# Altium project QUTMS_SteeringWheelV2-V01.PrjPcb
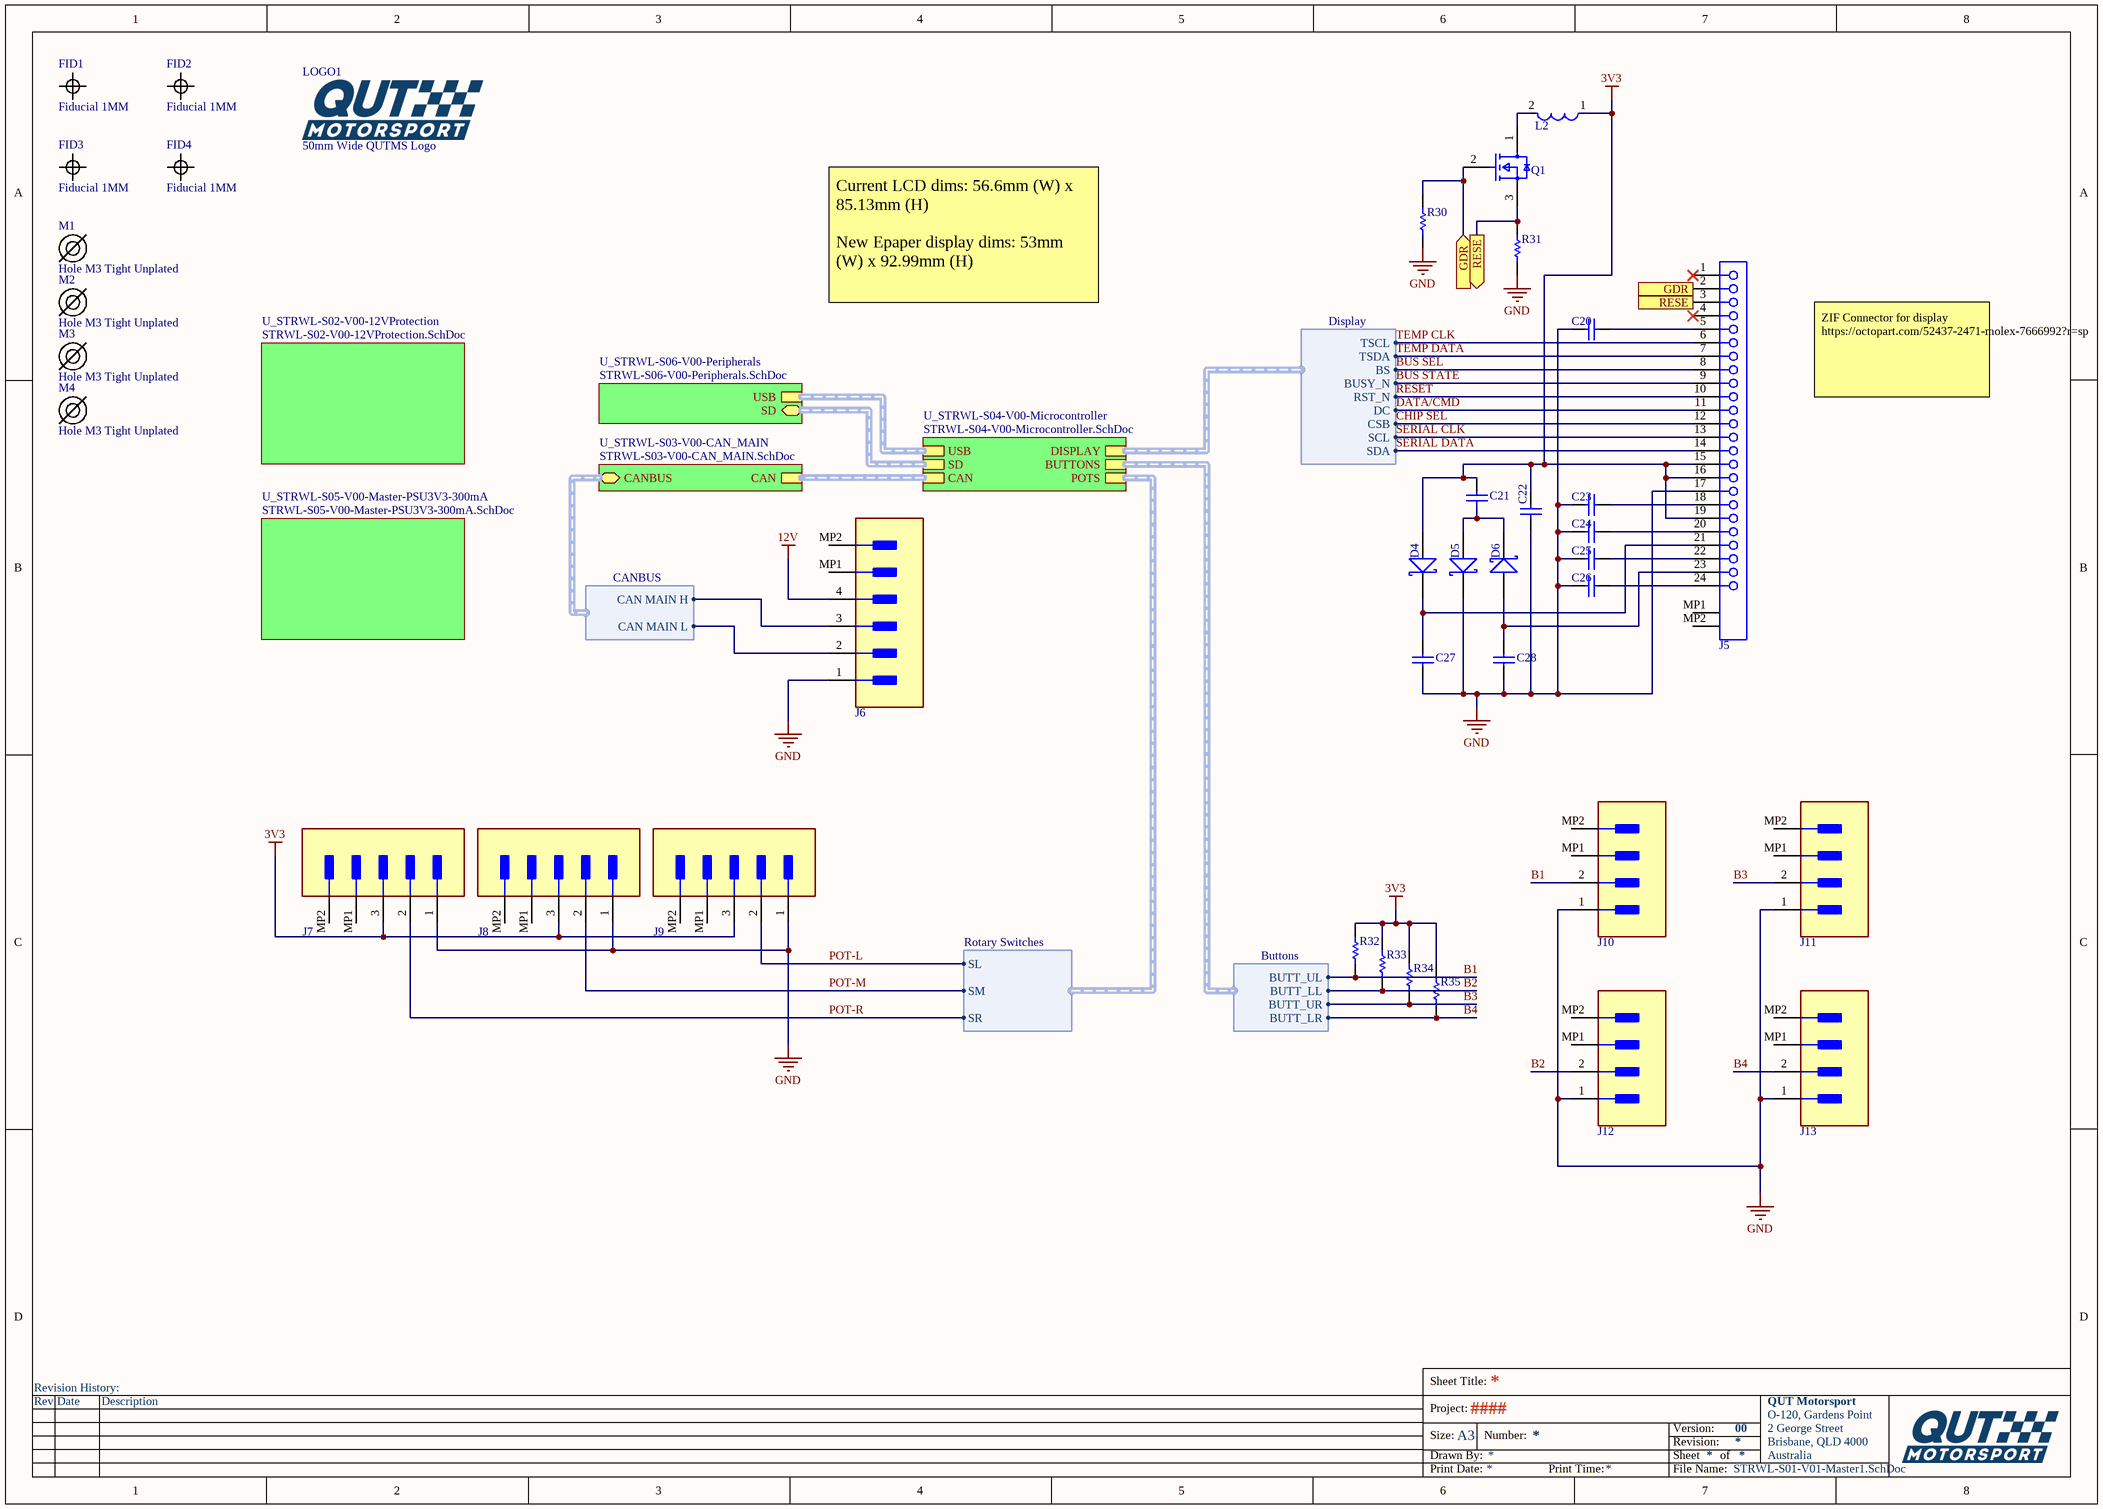
[diagram p0: STRWL-S01-V01-Master1.SchDoc]
4 sheets, 83 parts. Net scope: hierarchical (ports join the sheet entries above them; power ports are global).
Board file: STRWL-P01-V01.PcbDoc
Sheets:
  STRWL-S01-V01-Master1.SchDoc
    U_STRWL-S05-V00-Master-PSU3V3-300mA = STRWL-S05-V00-Master-PSU3V3-300mA.SchDoc
    U_STRWL-S06-V00-Peripherals = STRWL-S06-V00-Peripherals.SchDoc
    U_STRWL-S04-V00-Microcontroller = STRWL-S04-V00-Microcontroller.SchDoc

## Sheet STRWL-S01-V01-Master1.SchDoc
size A3; Version: 00; Project: ####; PageSetup: Record=PageOptions|CenterHorizontal=True|CenterVertical=True|PrintScale=0.97|XCorrection=1.00|YCorrection=1.00|PrintKind=0|BorderSize=5000000|LeftOffset=0|BottomOffset=0|Orientation=2|PaperLength=1000|PaperWidth=1000|Scale=100|PaperSource=7|PrintQuality=-4|MediaType=1|DitherType=10|PaperKind=A4|PrintScaleMode=1

### Parts
C20  1uF 25V 5% X7R 0603  [Cap_Ceramic_0603]  (value not drawn)
C21  4u7 50V 5% X7R 0603  [Cap_Ceramic_0603]  (value not drawn)
C22  1uF 25V 5% X7R 0603  [Cap_Ceramic_0603]  (value not drawn)
C23  1uF 25V 5% X7R 0603  [Cap_Ceramic_0603]  (value not drawn)
C24  1uF 25V 5% X7R 0603  [Cap_Ceramic_0603]  (value not drawn)
C25  1uF 25V 5% X7R 0603  [Cap_Ceramic_0603]  (value not drawn)
C26  1uF 25V 5% X7R 0603  [Cap_Ceramic_0603]  (value not drawn)
C27  1uF 25V 5% X7R 0603  [Cap_Ceramic_0603]  (value not drawn)
C28  1uF 25V 5% X7R 0603  [Cap_Ceramic_0603]  (value not drawn)
D4  STPS0530Z  [SOD123]  (value not drawn)
D5  STPS0530Z  [SOD123]  (value not drawn)
D6  STPS0530Z  [SOD123]  (value not drawn)
FID1  Fiducial 1MM  [FIDUCIAL 1MM]  (no BOM)
FID2  Fiducial 1MM  [FIDUCIAL 1MM]  (no BOM)
FID3  Fiducial 1MM  [FIDUCIAL 1MM]  (no BOM)
FID4  Fiducial 1MM  [FIDUCIAL 1MM]  (no BOM)
J5  52437-2471  [MOLX-52437-2471]  (value not drawn)
J6  JST PH 4 Way VERT SMD  [JST 4P VERT SMD]  (value not drawn)
J7  JST PH 3 Way VERT SMD  [JST 3P VERT SMD]  (value not drawn)
J8  JST PH 3 Way VERT SMD  [JST 3P VERT SMD]  (value not drawn)
J9  JST PH 3 Way VERT SMD  [JST 3P VERT SMD]  (value not drawn)
J10  JSP PH 2 Way VERT SMD  [JST 2P VERT SMD]  (value not drawn)
J11  JSP PH 2 Way VERT SMD  [JST 2P VERT SMD]  (value not drawn)
J12  JSP PH 2 Way VERT SMD  [JST 2P VERT SMD]  (value not drawn)
J13  JSP PH 2 Way VERT SMD  [JST 2P VERT SMD]  (value not drawn)
L2  LQM21FN100M70L  [Murata_LQM21FN_70_IPC_C]  (value not drawn)
LOGO1  50mm Wide QUTMS Logo  [QUTMS LOGO 50MM]  (no BOM)
M1  Hole M3 Tight Unplated  [M3.2 UNPLATED]
M2  Hole M3 Tight Unplated  [M3.2 UNPLATED]
M3  Hole M3 Tight Unplated  [M3.2 UNPLATED]
M4  Hole M3 Tight Unplated  [M3.2 UNPLATED]
Q1  MOSFET N-CH 30V 4A SOT323  [Diodes_SOT323_0]  (value not drawn)
R30  10k 1% 0603  [Res_ThinFilm_0603]  (value not drawn)
R31  0R47 5% 0603  [Res_ThinFilm_0603]  (value not drawn)
R32  10k 5% 0603  [Res_ThinFilm_0603]  (value not drawn)
R33  10k 5% 0603  [Res_ThinFilm_0603]  (value not drawn)
R34  10k 5% 0603  [Res_ThinFilm_0603]  (value not drawn)
R35  10k 5% 0603  [Res_ThinFilm_0603]  (value not drawn)

### Sub-sheets
U_STRWL-S02-V00-12VProtection = STRWL-S02-V00-12VProtection.SchDoc (file not in this document): no entries
U_STRWL-S03-V00-CAN_MAIN = STRWL-S03-V00-CAN_MAIN.SchDoc (file not in this document): CANBUS (bidir, harness CANBUS), CAN (harness CAN)
U_STRWL-S04-V00-Microcontroller = STRWL-S04-V00-Microcontroller.SchDoc: CAN (harness CAN), USB (harness USB), SD (harness SD), DISPLAY (harness Display), BUTTONS (harness Buttons), POTS (harness Rotary Switches)
U_STRWL-S05-V00-Master-PSU3V3-300mA = STRWL-S05-V00-Master-PSU3V3-300mA.SchDoc: no entries
U_STRWL-S06-V00-Peripherals = STRWL-S06-V00-Peripherals.SchDoc: USB (harness USB), SD (bidir, harness SD)

### Ports
GDR (in), GDR (out), RESE (in), RESE (out)

### Harnesses
CANBUS: CAN MAIN H, CAN MAIN L
Display: CSB, SCL, SDA, TSCL, TSDA, BS, BUSY_N, RST_N, DC
Buttons: BUTT_UL, BUTT_LL, BUTT_UR, BUTT_LR
Rotary Switches: SL, SM, SR

### Nets
3V3: C21.2 C22.2 D4.A J5.15 J5.16 J5.19 J7.3 J8.3 J9.3 L2.1 R32.1 R33.1 R34.2 R35.2
12V: J6.4
GND: C20.1 C22.1 C23.1 C24.1 C25.1 C26.1 C27.1 C28.1 D5.K J5.17 J6.1 J7.1 J8.1 J9.1 J10.1 J11.1 J12.1 J13.1 R30.2 R31.1
B1: J10.2 R32.2 ; sheet U_STRWL-S04-V00-Microcontroller/BUTTONS.BUTT_UL
B2: J12.2 R33.2 ; sheet U_STRWL-S04-V00-Microcontroller/BUTTONS.BUTT_LL
B3: J11.2 R34.1 ; sheet U_STRWL-S04-V00-Microcontroller/BUTTONS.BUTT_UR
B4: J13.2 R35.1 ; sheet U_STRWL-S04-V00-Microcontroller/BUTTONS.BUTT_LR
BUS SEL: J5.8 ; sheet U_STRWL-S04-V00-Microcontroller/DISPLAY.BS
BUS STATE: J5.9 ; sheet U_STRWL-S04-V00-Microcontroller/DISPLAY.BUSY_N
CHIP SEL: J5.12 ; sheet U_STRWL-S04-V00-Microcontroller/DISPLAY.CSB
DATA/CMD: J5.11 ; sheet U_STRWL-S04-V00-Microcontroller/DISPLAY.DC
POT-L: J9.2 ; sheet U_STRWL-S04-V00-Microcontroller/POTS.SL
POT-M: J8.2 ; sheet U_STRWL-S04-V00-Microcontroller/POTS.SM
POT-R: J7.2 ; sheet U_STRWL-S04-V00-Microcontroller/POTS.SR
RESET: J5.10 ; sheet U_STRWL-S04-V00-Microcontroller/DISPLAY.RST_N
SERIAL CLK: J5.13 ; sheet U_STRWL-S04-V00-Microcontroller/DISPLAY.SCL
SERIAL DATA: J5.14 ; sheet U_STRWL-S04-V00-Microcontroller/DISPLAY.SDA
TEMP CLK: J5.6 ; sheet U_STRWL-S04-V00-Microcontroller/DISPLAY.TSCL
TEMP DATA: J5.7 ; sheet U_STRWL-S04-V00-Microcontroller/DISPLAY.TSDA
NetC20_2: C20.2 J5.5
NetC21_1: C21.1 D5.A D6.K
NetC23_2: C23.2 J5.18
NetC24_2: C24.2 J5.20
NetC25_2: C25.2 J5.22
NetC26_2: C26.2 J5.24
NetC27_2: C27.2 D4.K J5.21
NetC28_2: C28.2 D6.A J5.23
NetJ5_2: J5.2 Q1.2(G) R30.1 ; port GDR
NetJ5_3: J5.3 Q1.3(S) R31.2 ; port RESE
NetJ6_2: J6.2 ; sheet U_STRWL-S03-V00-CAN_MAIN/CANBUS.CAN MAIN L
NetJ6_3: J6.3 ; sheet U_STRWL-S03-V00-CAN_MAIN/CANBUS.CAN MAIN H
NetL2_2: L2.2 Q1.1(D)

Not connected (* = marked no-connect by the designer): J5 1* 4* MP1 MP2; J6 MP1(MNT_1) MP2(MNT_2); J7 MP1(MNT_1) MP2(MNT_2); J8 MP1(MNT_1) MP2(MNT_2); J9 MP1(MNT_1) MP2(MNT_2); J10 MP1(MNT_1) MP2(MNT_2); J11 MP1(MNT_1) MP2(MNT_2); J12 MP1(MNT_1) MP2(MNT_2); J13 MP1(MNT_1) MP2(MNT_2)

### Buses and harness runs
harness sheet U_STRWL-S03-V00-CAN_MAIN/CAN = sheet U_STRWL-S04-V00-Microcontroller/CAN
harness sheet U_STRWL-S04-V00-Microcontroller/SD = sheet U_STRWL-S06-V00-Peripherals/SD
harness sheet U_STRWL-S04-V00-Microcontroller/USB = sheet U_STRWL-S06-V00-Peripherals/USB

### Notes on the sheet
- Current LCD dims: 56.6mm (W) x 85.13mm (H)
  New Epaper display dims: 53mm (W) x 92.99mm (H)
- ZIF Connector for display
  https://octopart.com/52437-2471-molex-7666992?r=sp
- Revision History:
- Sheet Title:
- Rev
- Date
- Description
- Project:
- Size:
- Drawn By:
- A3
- Number:
- Revision:
- Sheet
- Version:
- of
- QUT Motorsport
- O-120, Gardens Point
- 2 George Street
- Brisbane, QLD 4000
- Australia
- Print Date:
- Print Time:
- File Name:

### Library data of the parts
C20 C22-C28 = 1uF 25V 5% X7R 0603: Capacitor, Ceramic, SMD, 1uF, 25V, 5%, X7R, 0603
C21 = 4u7 50V 5% X7R 0603: Capacitor, Ceramic, SMD, 4u7, 50V, 5%, X7R, 0603
D4-D6 = STPS0530Z: Diode, Schottky Barrier Rectifier, 30 V, 0.5 A, STPS0530Z
J5 = 52437-2471: 0.5 mm Pitch Easy-On(TM) Type FPC Connector, Right Angle, ZIF, SMT, Bottom Contact, 24 Circuits, -40 to 85 degC, ELV and RoHS Compliant, Tape and Reel; Manufacturer: Molex; Durability (mating cycles max): 20; Material - Metal: Phosphor Bronze; Polarized to PCB: Yes; Voltage (Max): 50V; Entry Angle: 90degrees Angle; PCB Locator: No; Material - Plating Termination: Gold; Current (Max per Contact): 0.5A; PCB Retention: None; Pitch - Mating Interface: 0.50mm; Circuits (Loaded): 24; Contact Position: Bottom; PartNumber: 52437-2471; ComponentLink1Description: Manufacturer URL; ComponentLink2Description: Datasheet; ComponentLink3URL: http://www.molex.com/pdm_docs/sd/524372471_sd.pdf; ComponentLink3Description: Package Specification; ComponentLink1URL: http://www.molex.com/molex/index.jsp; Packing: Tape and Reel; Number of Rows: 1; ComponentLink2URL: http://www.molex.com/webdocs/datasheets/pdf/en-us/0524372471_FFC_FPC_CONNECTORS.pdf; PackageVersion: Rev. E, 07/2013; RoHS: TRUE; Material - Plating Mating: Gold; Orientation: Right Angle; Stackable: No; Mounting Technology: Surface Mount; PackageReference: 52437-2471; PackageDescription: 24-Lead FPC Connector, Pitch 0.5 mm
J10-J13 = JSP PH 2 Way VERT SMD: Manufacturer: JST; Category Bda670Ac885E6661: Uncategorized; Category E7012A0Bd22E3Cc6: Headers & Receptacles; contact_material: Brass; pin_pitch: 2 mm; size_length: 7.95 mm; Num Pins: 2; voltage_rating_ac: 100 V; contact_plating: Tin; Category Dab617Bcef8C0171: PC Board; Category E42C2926D3763Feb: Wire to Board; number_of_rows: 1; Category 75Fab8F04590Ae3D: Connectors and Adapters; size_width: 5 mm; gender: Female; current_rating: 2 A; size_height: 6.6 mm; insulation_resistance: 1 GΩ; Category 0836C53C3D42D3F1: Connectors; helpURL: https://upverter.com/upn/revision/aa2260f5f3c02952/; ComponentLink2Description: Datasheet; Temperature: -25˚C to +85˚C; Package: CONN_SMT_7MM95_5MM0; Supplier 2: Mouser; Price: 0.401172514632; Supplier 1: Digi-Key; ComponentLink1URL: https://upverter.com/upn/revision/aa2260f5f3c02952/; Supplier Part Number 1: 455-1734-1-ND; ComponentLink1Description: Upverter; ComponentLink2URL: https://upverter.com/datasheet/05f4473ffc638d76a3bb68900fd4324175be47ba.pdf; RoHS: TRUE; color: White; Category Fcf631Fcc9332731: Uncategorized; number_of_contacts: 2; Temperature Range Low: -25˚C; Digikey Part Number: 455-1734-1-ND; housing_color: Natural; Category A3C16Ecb93907806: Uncategorized; Temperature Range High: +85˚C; Lead Free: yes; flammability_rating: UL 94 V-0; Digikey Description: CONN 2 Positions Header, Shrouded Connector 0.079" (2.00mm) Surface Mount Tin; number_of_positions: 2; housing_material: Nylon; Mounting Type: surface mount
LOGO1 = QUTMS Logo 50mm
M1-M4 = Hole M3 Tight Unplated: M3.2 Hole, No Plating
Q1 = DMN3065LW-13: N-Channel 30V 4A (Ta) 770mW (Ta) Surface Mount SOT-323
R30 = 10k 1% 0603: Resistor, SMD, 10k, 0.1W, 1%, 0603
R31 = 0R47 5% 0603_1: Resistor, SMD, 0R, 0.1W, 5%, 0603
R32-R35 = 10k 5% 0603: Resistor, SMD, 10k, 0.1W, 5%, 0603

## Sheet STRWL-S05-V00-Master-PSU3V3-300mA.SchDoc: Power Supply (20-40V to 3v3 @ 0.1-0.6A)
size A3; DrawnBy: Jonn Dillon; DocumentNumber: 2; Revision: 01; SheetNumber: 5; SheetTotal: 7; Version: 01; Project: AMU 2020 (Sourced from BMS 2020); PageSetup: Record=PageOptions|CenterHorizontal=True|CenterVertical=True|PrintScale=0.97|XCorrection=1.00|YCorrection=1.00|PrintKind=0|BorderSize=5000000|LeftOffset=0|BottomOffset=0|Orientation=2|PaperLength=1000|PaperWidth=1000|Scale=100|PaperSource=7|PrintQuality=-4|MediaType=1|DitherType=10|PaperKind=A4|PrintScaleMode=1
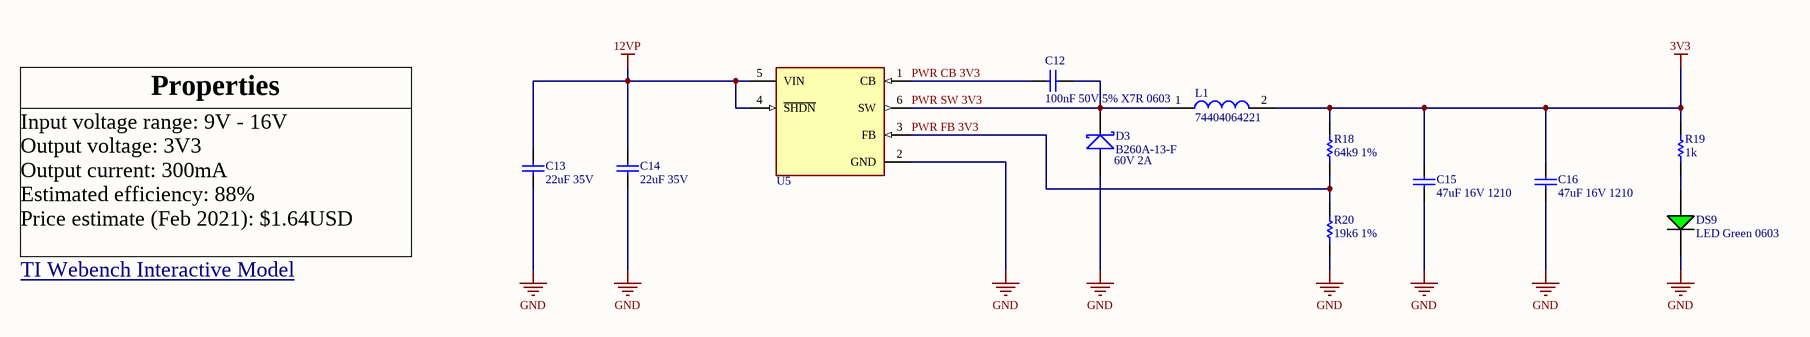
[diagram p1: STRWL-S05-V00-Master-PSU3V3-300mA.SchDoc]

### Parts
C12  100nF 50V 5% X7R 0603  [Cap_Ceramic_0603]
C13  22uF 35V  [Cap_Ceramic_1206]
C14  22uF 35V  [Cap_Ceramic_1206]
C15  47uF 16V 1210  [Cap_Ceramic_1210]
C16  47uF 16V 1210  [Cap_Ceramic_1210]
D3  B260A-13-F  [SMA]
DS9  LED Green 0603  [LED GREEN 0603]
L1  74404064221  [Inductor_6x6mm]
R18  64k9 1%  [Res_ThinFilm_0603]
R19  1k  [Res_ThinFilm_0603]
R20  19k6 1%  [Res_ThinFilm_0603]
U5  LMR14010ADDCR  [Texas_Instruments_DDC0006A_IPC_A]  (value not drawn)

### Nets
3V3: C15.2 C16.2 L1.2 R18.2 R19.2
12VP: C13.1 C14.1 U5.4(~{SHDN}) U5.5(VIN)
GND: C13.2 C14.2 C15.1 C16.1 D3.A DS9.2(C) R20.1 U5.2(GND)
PWR CB 3V3: C12.1 U5.1(CB)
PWR FB 3V3: R18.1 R20.2 U5.3(FB)
PWR SW 3V3: C12.2 D3.K L1.1 U5.6(SW)
NetDS9_1: DS9.1(A) R19.1

### Notes on the sheet
- Properties
- (near D3) 60V 2A
- Input voltage range: 9V - 16V
  Output voltage: 3V3
  Output current: 300mA
  Estimated efficiency: 88%
  Price estimate (Feb 2021): $1.64USD
- TI Webench Interactive Model <https://webench.ti.com/power-designer/switching-regulator/customize/16?O1I=0.3&O1V=3.3&VinMax=16.0&VinMin=9.0&action=schematic&base_pn=LMR14010A&lang_chosen=en_US&op_TA=30.0&optFactor=3&origin=ODS__LMR14010A>
- Title
- Size:
- Date:
- A3
- Number:
- Time:
- Revision:
- Sheet
- of
- File:

### Library data of the parts
C12 = 100nF 50V 5% X7R 0603: Capacitor, Ceramic, SMD, 100nF, 50V, 5%, X7R, 0603
C13 C14 = 22uF 35V 20% X5R 1206: 22µF ±20% 35V Ceramic Capacitor X5R 1206 (3216 Metric); ComponentLink1Description: Digikey; ComponentLink1URL: https://www.digikey.com.au/product-detail/en/tdk-corporation/C3216X5R1V226M160AC/445-8045-1-ND/2792165; ComponentLink2Description: Datasheet; ComponentLink2URL: https://product.tdk.com/info/en/catalog/datasheets/mlcc_commercial_general_en.pdf
C15 C16 = 47uF 16V 10% X7R 1210: Capacitor, Ceramic, SMD, 47uF, 16V, 5%, X7R, 1210
D3 = B260A-13-F: Diode, Schottky Barrier Rectifier, 60 V, 2 A, B260A-13-F
L1 = 74404064221: FIXED IND 220UH 660MA 850 MOHM; ComponentLink1Description: Digikey; ComponentLink1URL: https://www.digikey.com.au/product-detail/en/w%C3%BCrth-elektronik/74404064221/732-7261-1-ND/5353241; ComponentLink2Description: LCSC A; ComponentLink2URL: https://lcsc.com/product-detail/Power-Inductors_Sunlord-SWPA6045S221MT_C91047.html; ComponentLink3Description: LCSC B; ComponentLink3URL: https://lcsc.com/product-detail/Power-Inductors_SXN-Shun-Xiang-Nuo-Elec-SMNR6045-221MT_C467145.html
R18 = 64k9 1% 0603: Resistor, SMD, 64k9, 0.1W, 5%, 0603
R19 = 1k 5% 0603: Resistor, SMD, 1k, 0.1W, 5%, 0603
R20 = 19k6 1% 0603: Resistor, SMD, 19k6, 0.1W, 5%, 0603

## Sheet STRWL-S06-V00-Peripherals.SchDoc: Peripherals
size A3; DrawnBy: John Hatfield; SheetNumber: 6; SheetTotal: 6
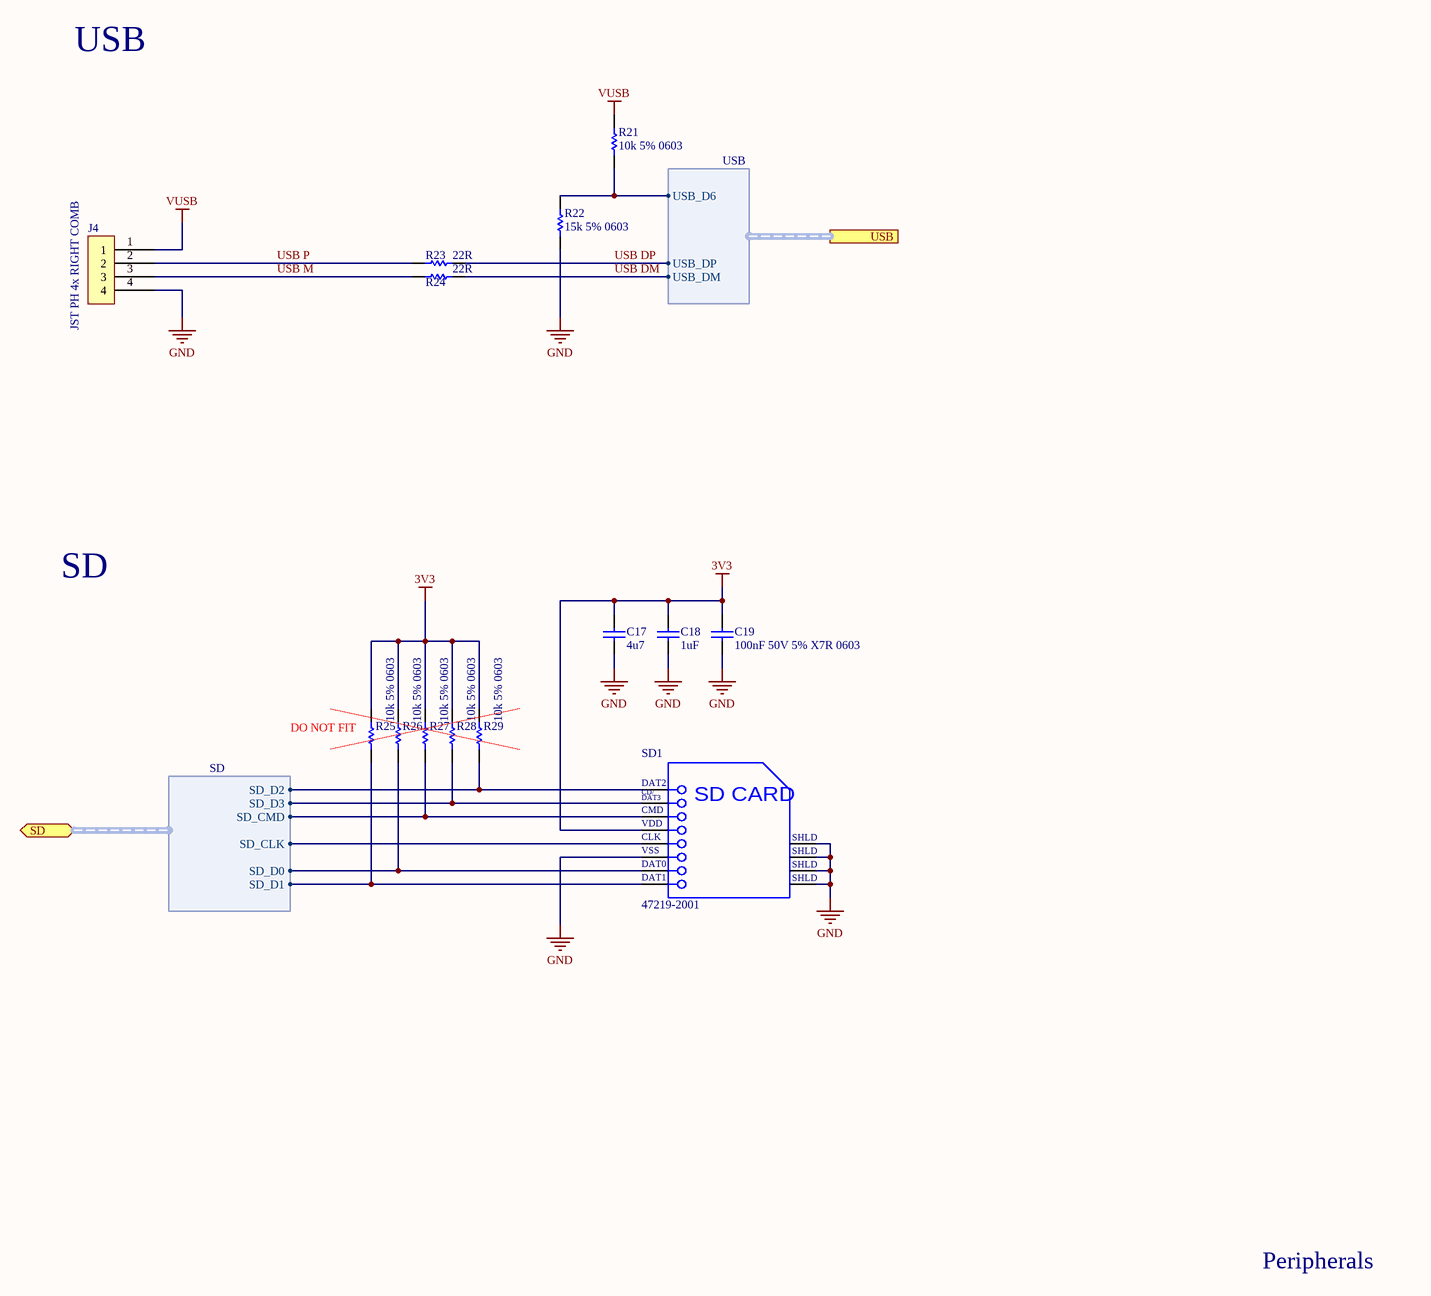
[diagram p2: STRWL-S06-V00-Peripherals.SchDoc]

### Parts
C17  4u7  [Cap_Ceramic_0603]
C18  1uF  [Cap_Ceramic_0603]
C19  100nF 50V 5% X7R 0603  [Cap_Ceramic_0603]
J4  JST PH 4x RIGHT COMB  [JST PH 4x RIGHT COMB]
R21  10k 5% 0603  [Res_ThinFilm_0603]
R22  15k 5% 0603  [Res_ThinFilm_0603]
R23  22R  [Res_ThinFilm_0603]
R24  22R  [Res_ThinFilm_0603]
R25  10k 5% 0603  [Res_ThinFilm_0603]
R26  10k 5% 0603  [Res_ThinFilm_0603]
R27  10k 5% 0603  [Res_ThinFilm_0603]
R28  10k 5% 0603  [Res_ThinFilm_0603]
R29  10k 5% 0603  [Res_ThinFilm_0603]
SD1  47219-2001  [47219-2001]

### Ports
SD (bidir, harness SD), USB (harness USB)

### Harnesses
USB: USB_DP, USB_D6, USB_DM
SD: SD_D2, SD_D3, SD_CMD, SD_CLK, SD_D0, SD_D1

### Nets
3V3: C17.2 C18.2 C19.2 R25.2 R26.2 R27.2 R28.2 R29.2 SD1.4(VDD)
GND: C17.1 C18.1 C19.1 J4.4 R22.1 SD1.6(VSS) SD1.9(SHLD) SD1.10(SHLD) SD1.11(SHLD) SD1.12(SHLD)
VUSB: J4.1 R21.2
SD_CMD: R27.1 SD1.3(CMD) ; port SD.SD_CMD
SD_D0: R26.1 SD1.7(DAT0) ; port SD.SD_D0
SD_D1: R25.1 SD1.8(DAT1) ; port SD.SD_D1
SD_D2: R29.1 SD1.1(DAT2) ; port SD.SD_D2
SD_D3: R28.1 SD1.2(CD/DAT3) ; port SD.SD_D3
SDIO_CK: SD1.5(CLK) ; port SD.SD_CLK
USB DM: R24.2 ; port USB.USB_DM
USB DP: R23.2 ; port USB.USB_DP
USB M: J4.3 R24.1
USB P: J4.2 R23.1
USB_D6: R21.1 R22.2 ; port USB.USB_D6

### Notes on the sheet
- USB
- SD
- (near R25) DO NOT FIT
- Peripherals
- (in symbol 47219-2001) CD/; DAT3; SD CARD

### Library data of the parts
C17 = 4u7 50V 5% X7R 0603: as C21 on sheet STRWL-S01-V01-Master1
C18 = 1uF 25V 5% X7R 0603: as C20 on sheet STRWL-S01-V01-Master1
C19 = 100nF 50V 5% X7R 0603: as C12 on sheet STRWL-S05-V00-Master-PSU3V3-300mA
R21 R25-R29 = 10k 5% 0603: Resistor, SMD, 10k, 0.1W, 5%, 0603
R22 = 15k 5% 0603: Resistor, SMD, 15k, 0.1W, 5%, 0603
R23 R24 = 22R 1% 0603: Resistor, SMD, 22R, 0.1W, 1%, 0603
SD1 = 47219-2001: MicroSD Card Connector, Hinge Type, -40 to 85 degC, 8-Pin SMD, RoHS, Tape and Reel

## Sheet STRWL-S04-V00-Microcontroller.SchDoc: STRWL Microcontroller
size A3; DrawnBy: John Hatfield; DocumentNumber: 4; Revision: 01; SheetNumber: 4; SheetTotal: 6; Version: 01; Project: STRWL QEV3; PageSetup: Record=PageOptions|CenterHorizontal=True|CenterVertical=True|PrintScale=0.97|XCorrection=1.00|YCorrection=1.00|PrintKind=0|BorderSize=5000000|LeftOffset=0|BottomOffset=0|Orientation=2|PaperLength=1000|PaperWidth=1000|Scale=100|PaperSource=7|PrintQuality=-4|MediaType=1|DitherType=10|PaperKind=A4|PrintScaleMode=1
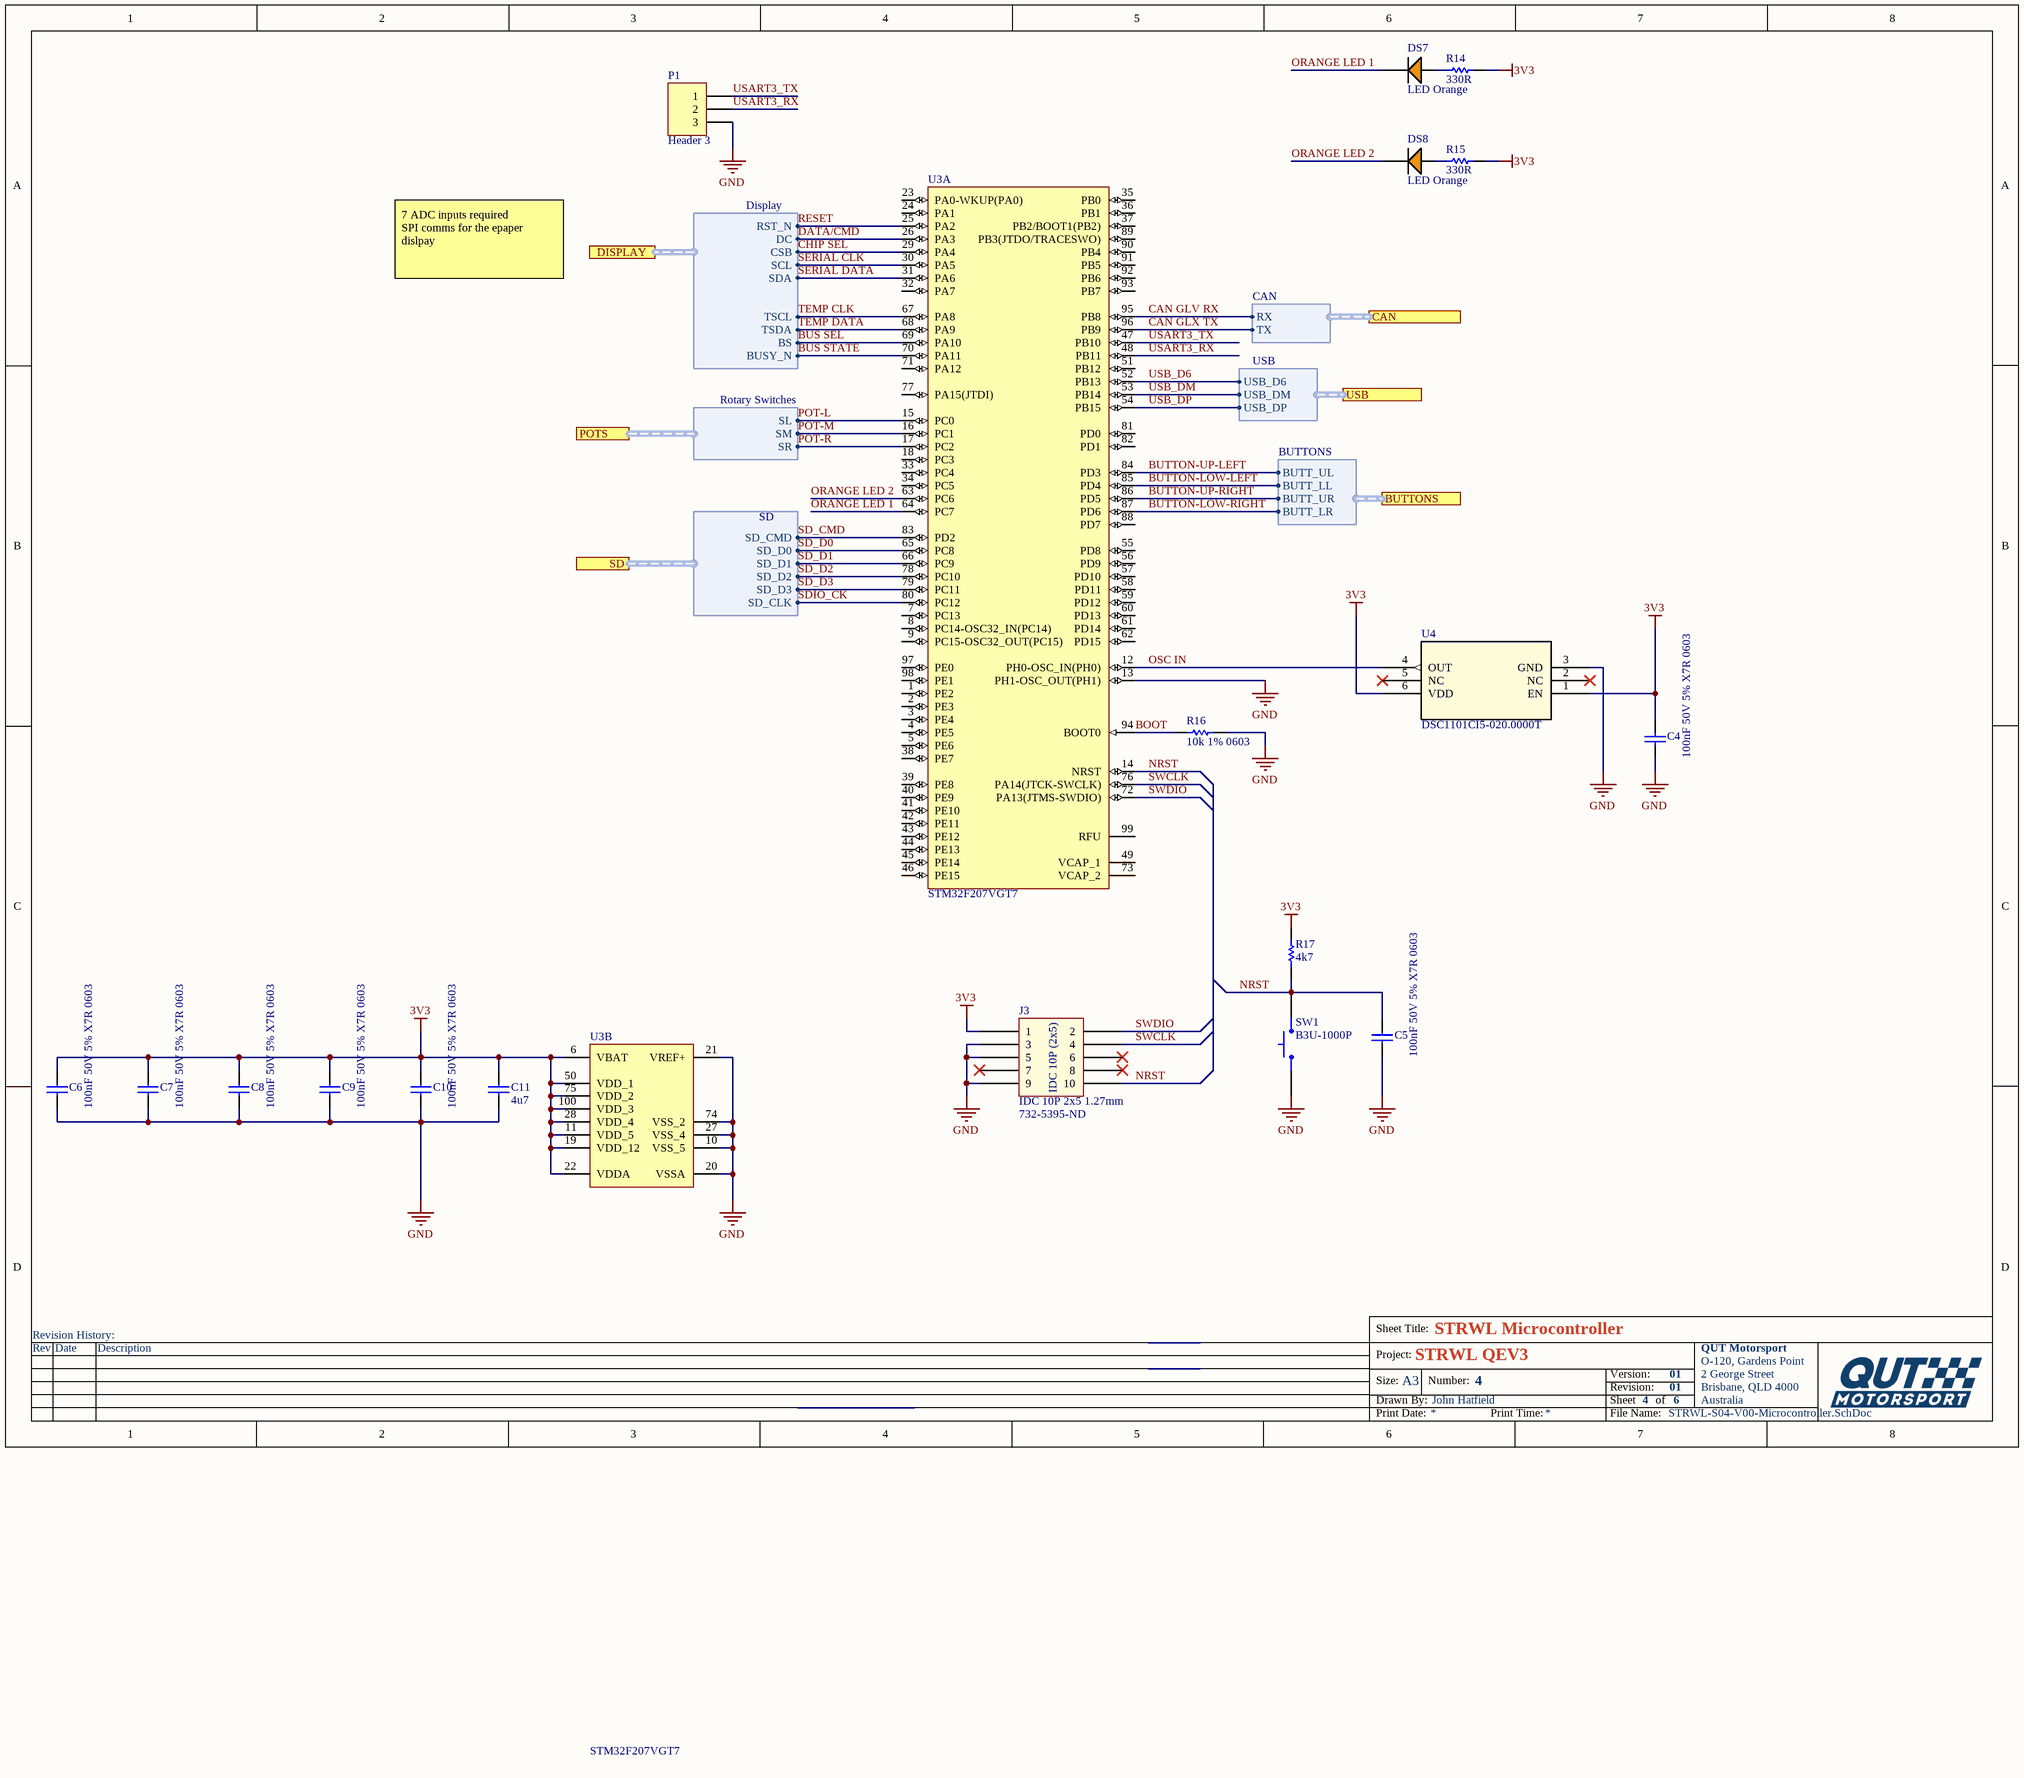
[diagram p3: STRWL-S04-V00-Microcontroller.SchDoc]

### Parts
C4  100nF 50V 5% X7R 0603  [Cap_Ceramic_0603]
C5  100nF 50V 5% X7R 0603  [Cap_Ceramic_0603]
C6  100nF 50V 5% X7R 0603  [Cap_Ceramic_0603]
C7  100nF 50V 5% X7R 0603  [Cap_Ceramic_0603]
C8  100nF 50V 5% X7R 0603  [Cap_Ceramic_0603]
C9  100nF 50V 5% X7R 0603  [Cap_Ceramic_0603]
C10  100nF 50V 5% X7R 0603  [Cap_Ceramic_0603]
C11  4u7  [Cap_Ceramic_0603]
DS7  LED Orange  [LED ORANGE 0603]
DS8  LED Orange  [LED ORANGE 0603]
J3  IDC 10P 2x5 1.27mm  [IDC 1.27MM 10P]
P1  Header 3  [HDR1X3]
R14  330R  [Res_ThinFilm_0603]
R15  330R  [Res_ThinFilm_0603]
R16  10k 1% 0603  [Res_ThinFilm_0603]
R17  4k7  [Res_ThinFilm_0603]
SW1  B3U-1000P  [BTN B3U-1000P]
U3  STM32F207VGT7  [STM-LQFP100_N]  (parts A,B of 2)
U4  DSC1101CI5-020.0000T  [VDFN6_3P2X2P5_MCH]

### Ports
BUTTONS (harness BUTTONS), CAN (harness CAN), DISPLAY (harness Display), POTS (harness Rotary Switches), SD (harness SD), USB (harness USB)

### Harnesses
CAN: RX, TX
USB: USB_DM, USB_DP, USB_D6
SD: SD_D0, SD_D1, SD_D2, SD_D3, SD_CLK, SD_CMD
Display: RST_N, DC, CSB, SCL, SDA, TSCL, TSDA, BS, BUSY_N
BUTTONS: BUTT_UL, BUTT_LL, BUTT_UR, BUTT_LR
Rotary Switches: SL, SM, SR

### Nets
3V3: C4.2 C6.2 C7.2 C8.2 C9.2 C10.2 C11.2 J3.1 R14.2 R15.2 R17.2 U3.6(VBAT) U3.11(VDD_5) U3.19(VDD_12) U3.22(VDDA) U3.28(VDD_4) U3.50(VDD_1) U3.75(VDD_2) U3.100(VDD_3) U4.1(EN) U4.6(VDD)
GND: C4.1 C5.1 C6.1 C7.1 C8.1 C9.1 C10.1 C11.1 J3.3 J3.5 J3.9 P1.3 R16.2 SW1.1 U3.10(VSS_5) U3.13(PH1-OSC_OUT(PH1)) U3.20(VSSA) U3.21(VREF+) U3.27(VSS_4) U3.74(VSS_2) U4.3(GND)
BOOT: R16.1 U3.94(BOOT0)
BUS SEL: U3.69(PA10) ; port DISPLAY.BS
BUS STATE: U3.70(PA11) ; port DISPLAY.BUSY_N
BUTTON-LOW-LEFT: U3.85(PD4) ; port BUTTONS.BUTT_LL  [project net B2]
BUTTON-LOW-RIGHT: U3.87(PD6) ; port BUTTONS.BUTT_LR  [project net B4]
BUTTON-UP-LEFT: U3.84(PD3) ; port BUTTONS.BUTT_UL  [project net B1]
BUTTON-UP-RIGHT: U3.86(PD5) ; port BUTTONS.BUTT_UR  [project net B3]
CAN GLV RX: U3.95(PB8) ; port CAN.RX
CAN GLX TX: U3.96(PB9) ; port CAN.TX
CHIP SEL: U3.29(PA4) ; port DISPLAY.CSB
DATA/CMD: U3.26(PA3) ; port DISPLAY.DC
NRST: C5.2 J3.10 R17.1 SW1.2 U3.14(NRST)
ORANGE LED 1: DS7.2(C) U3.64(PC7)
ORANGE LED 2: DS8.2(C) U3.63(PC6)
OSC IN: U3.12(PH0-OSC_IN(PH0)) U4.4(OUT)
POT-L: U3.15(PC0) ; port POTS.SL
POT-M: U3.16(PC1) ; port POTS.SM
POT-R: U3.17(PC2) ; port POTS.SR
RESET: U3.25(PA2) ; port DISPLAY.RST_N
SD_CMD: U3.83(PD2) ; port SD.SD_CMD
SD_D0: U3.65(PC8) ; port SD.SD_D0
SD_D1: U3.66(PC9) ; port SD.SD_D1
SD_D2: U3.78(PC10) ; port SD.SD_D2
SD_D3: U3.79(PC11) ; port SD.SD_D3
SDIO_CK: U3.80(PC12) ; port SD.SD_CLK
SERIAL CLK: U3.30(PA5) ; port DISPLAY.SCL
SERIAL DATA: U3.31(PA6) ; port DISPLAY.SDA
SWCLK: J3.4 U3.76(PA14(JTCK-SWCLK))
SWDIO: J3.2 U3.72(PA13(JTMS-SWDIO))
TEMP CLK: U3.67(PA8) ; port DISPLAY.TSCL
TEMP DATA: U3.68(PA9) ; port DISPLAY.TSDA
USART3_RX: P1.2 U3.48(PB11)
USART3_TX: P1.1 U3.47(PB10)
USB_D6: U3.52(PB13) ; port USB.USB_D6
USB_DM: U3.53(PB14) ; port USB.USB_DM  [project net USB DM]
USB_DP: U3.54(PB15) ; port USB.USB_DP  [project net USB DP]
NetDS7_1: DS7.1(A) R14.1
NetDS8_1: DS8.1(A) R15.1

Not connected (* = marked no-connect by the designer): J3 6* 7* 8*; U3 1(PE2) 2(PE3) 3(PE4) 4(PE5) 5(PE6) 7(PC13) 8(PC14-OSC32_IN(PC14)) 9(PC15-OSC32_OUT(PC15)) 18(PC3) 23(PA0-WKUP(PA0)) 24(PA1) 32(PA7) 33(PC4) 34(PC5) 35(PB0) 36(PB1) 37(PB2/BOOT1(PB2)) 38(PE7) 39(PE8) 40(PE9) 41(PE10) 42(PE11) 43(PE12) 44(PE13) 45(PE14) 46(PE15) 49(VCAP_1) 51(PB12) 55(PD8) 56(PD9) 57(PD10) 58(PD11) 59(PD12) 60(PD13) 61(PD14) 62(PD15) 71(PA12) 73(VCAP_2) 77(PA15(JTDI)) 81(PD0) 82(PD1) 88(PD7) 89(PB3(JTDO/TRACESWO)) 90(PB4) 91(PB5) 92(PB6) 93(PB7) 97(PE0) 98(PE1) 99(RFU); U4 2(NC)* 5(NC)*

### Notes on the sheet
- 7 ADC inputs required
  SPI comms for the epaper dislpay
- (near J3) 732-5395-ND
- Revision History:
- Sheet Title:
- Rev
- Date
- Description
- Project:
- Size:
- Drawn By:
- A3
- Number:
- Revision:
- Sheet
- Version:
- of
- QUT Motorsport
- O-120, Gardens Point
- 2 George Street
- Brisbane, QLD 4000
- Australia
- Print Date:
- Print Time:
- File Name:
- (in symbol IDC 10P 2x5 1.27mm) IDC 10P (2x5)

### Library data of the parts
C4-C10 = 100nF 50V 5% X7R 0603: as C12 on sheet STRWL-S05-V00-Master-PSU3V3-300mA
C11 = 4u7 50V 5% X7R 0603: as C21 on sheet STRWL-S01-V01-Master1
DS7 DS8 = LED ORANGE 0603
P1 = Header 3: Header, 3-Pin; LatestRevisionDate: 17-Jul-2002; LatestRevisionNote: Re-released for DXP Platform.; Publisher: Altium Limited
R14 R15 = 330R 5% 0603: Resistor, SMD, 330R, 0.1W, 5%, 0603
R16 = 20k 1% 0603: Resistor, SMD, 20k, 0.1W, 5%, 0603
R17 = 4k7 5% 0603: Resistor, SMD, 4k7, 0.1W, 5%, 0603
SW1 = BTN B3U-1000P: Omron B3U-1000P Ultra Miniture Switch; ComponentLink1Description: LCSC; ComponentLink1URL: https://lcsc.com/product-detail/Tactile-Switches_BRIGHT-TSA063G50-250_C294565.html
U3 = STM32F207VGT7-Custom: ARM Cortex-M3 32-bit MCU, 1024 KB Flash, 128 KB Internal RAM, 82 I/Os, 100-pin LQFP, -40 to 105 degC, Tray; D/A Converter: 2x12-bit (2 Channel); Internal RAM Size (kB): 128; Supply Voltage(Vcc) min (V): 1.8; I/Os (High Current): 82; Operating Frequency(F) (Processor speed) (MHz): 120; FLASH Size (Prog) (kB): 1024; PartNumber: STM32F207VGT7; DatasheetVersion: Rev. 9; Core: ARM Cortex-M3; ComponentLink3Description: Package Specification; ComponentLink3URL: http://www.st.com/st-web-ui/static/active/en/resource/technical/document/data_brief/DM00071938.pdf; PackageDescription: 100-Pin Low Profile Quad Flat Package, 14 x 14 mm Body, 0.5 mm Pitch; ComponentLink1Description: Manufacturer URL; PackageVersion: Rev. 1, 06/2013; ComponentLink1URL: http://www.st.com/web/en/home.html; PackageReference: LQFP100; ComponentLink2Description: Datasheet; ComponentLink2URL: http://www.st.com/st-web-ui/static/active/en/resource/technical/document/datasheet/CD00237391.pdf; Mounting Technology: Surface Mount; Packing: Tray
U4 = DSC1101CI5-020.0000T: No Description Available; Vendor: Microchip; Built_By: EMA_Jessica; SourceLibrary: Microchip_2019-08-23_23; Manufacturer_Part_Number: DSC1101CI5-020.0000T; Copyright: Copyright (C) 2018 Accelerated Designs. All rights reserved; RefDes: RefDes; Type: DEV

## Nets that join several sheets
3V3: STRWL-S01-V01-Master1 (14 pins), STRWL-S05-V00-Master-PSU3V3-300mA (5 pins), STRWL-S06-V00-Peripherals (9 pins), STRWL-S04-V00-Microcontroller (21 pins)
GND: STRWL-S01-V01-Master1 (20 pins), STRWL-S05-V00-Master-PSU3V3-300mA (8 pins), STRWL-S06-V00-Peripherals (10 pins), STRWL-S04-V00-Microcontroller (21 pins)
B1: STRWL-S01-V01-Master1 (J10.2 R32.2), STRWL-S04-V00-Microcontroller (U3.84)
B2: STRWL-S01-V01-Master1 (J12.2 R33.2), STRWL-S04-V00-Microcontroller (U3.85)
B3: STRWL-S01-V01-Master1 (J11.2 R34.1), STRWL-S04-V00-Microcontroller (U3.86)
B4: STRWL-S01-V01-Master1 (J13.2 R35.1), STRWL-S04-V00-Microcontroller (U3.87)
BUS SEL: STRWL-S01-V01-Master1 (J5.8), STRWL-S04-V00-Microcontroller (U3.69)
BUS STATE: STRWL-S01-V01-Master1 (J5.9), STRWL-S04-V00-Microcontroller (U3.70)
CHIP SEL: STRWL-S01-V01-Master1 (J5.12), STRWL-S04-V00-Microcontroller (U3.29)
DATA/CMD: STRWL-S01-V01-Master1 (J5.11), STRWL-S04-V00-Microcontroller (U3.26)
POT-L: STRWL-S01-V01-Master1 (J9.2), STRWL-S04-V00-Microcontroller (U3.15)
POT-M: STRWL-S01-V01-Master1 (J8.2), STRWL-S04-V00-Microcontroller (U3.16)
POT-R: STRWL-S01-V01-Master1 (J7.2), STRWL-S04-V00-Microcontroller (U3.17)
RESET: STRWL-S01-V01-Master1 (J5.10), STRWL-S04-V00-Microcontroller (U3.25)
SD_CMD: STRWL-S06-V00-Peripherals (R27.1 SD1.3), STRWL-S04-V00-Microcontroller (U3.83)
SD_D0: STRWL-S06-V00-Peripherals (R26.1 SD1.7), STRWL-S04-V00-Microcontroller (U3.65)
SD_D1: STRWL-S06-V00-Peripherals (R25.1 SD1.8), STRWL-S04-V00-Microcontroller (U3.66)
SD_D2: STRWL-S06-V00-Peripherals (R29.1 SD1.1), STRWL-S04-V00-Microcontroller (U3.78)
SD_D3: STRWL-S06-V00-Peripherals (R28.1 SD1.2), STRWL-S04-V00-Microcontroller (U3.79)
SDIO_CK: STRWL-S06-V00-Peripherals (SD1.5), STRWL-S04-V00-Microcontroller (U3.80)
SERIAL CLK: STRWL-S01-V01-Master1 (J5.13), STRWL-S04-V00-Microcontroller (U3.30)
SERIAL DATA: STRWL-S01-V01-Master1 (J5.14), STRWL-S04-V00-Microcontroller (U3.31)
TEMP CLK: STRWL-S01-V01-Master1 (J5.6), STRWL-S04-V00-Microcontroller (U3.67)
TEMP DATA: STRWL-S01-V01-Master1 (J5.7), STRWL-S04-V00-Microcontroller (U3.68)
USB DM: STRWL-S06-V00-Peripherals (R24.2), STRWL-S04-V00-Microcontroller (U3.53)
USB DP: STRWL-S06-V00-Peripherals (R23.2), STRWL-S04-V00-Microcontroller (U3.54)
USB_D6: STRWL-S06-V00-Peripherals (R21.1 R22.2), STRWL-S04-V00-Microcontroller (U3.52)